# EAGLE design attiny_programmer (EAGLE 8.3.2)
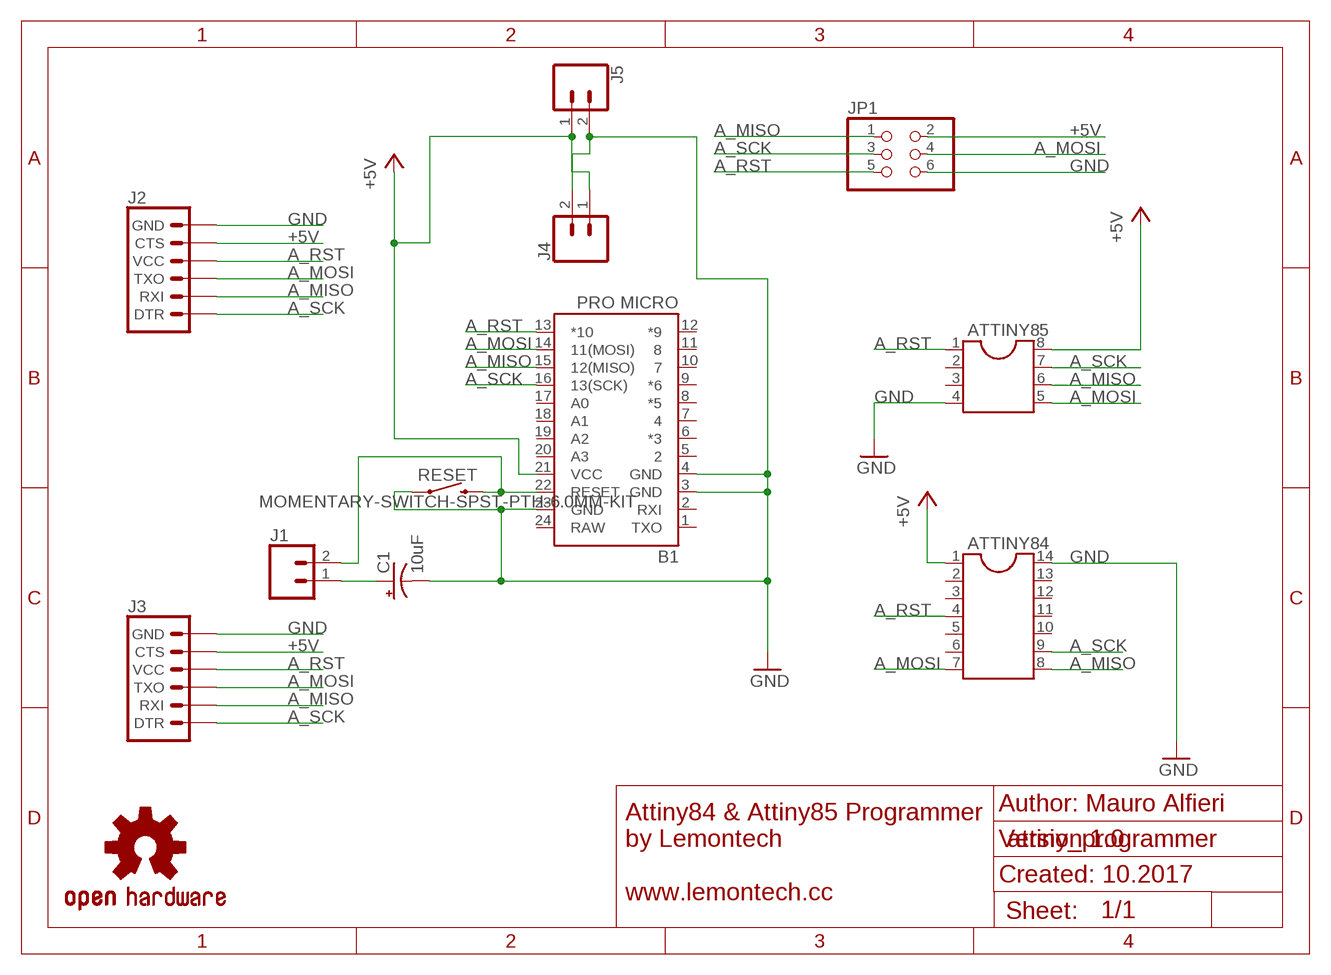
[diagram p0: schematic, sheet 1]

## Parts
ATTINY84  DIL14S  [SOCKET-14]
ATTINY85  DIL8S  [SOCKET-08]
B1  PRO MICRO  SPARKFUN_PRO_MICRO  [SPARKFUN_PRO_MICRO]
C1  10uF  10UF-POLAR-RADIAL-2.5MM-25V-20%  [CPOL-RADIAL-2.5MM-5MM]
J1  CONN_02  [1X02]
J2  6_PIN_SERIAL_TARGETLONGPADS  [1X06_LONGPADS]
J3  6_PIN_SERIAL_TARGETLONGPADS  [1X06_LONGPADS]
J4  CONN_02  [1X02]
J5  CONN_02  [1X02]
JP1  PINHD-2X3  [2X03]
LOGO1  OSHW-LOGOMINI  [OSHW-LOGO-MINI]
RESET  MOMENTARY-SWITCH-SPST-PTH-6.0MM-KIT  [TACTILE_SWITCH_PTH_6.0MM_KIT]

## Nets
+5V: ATTINY84.1 ATTINY85.8 B1.21(VCC) J2.5(CTS) J3.5(CTS) J4.1 J5.1 JP1.2
A_MISO: ATTINY84.8 ATTINY85.6 B1.15(12(MISO)) J2.2(RXI) J3.2(RXI) JP1.1
A_MOSI: ATTINY84.7 ATTINY85.5 B1.14(11(MOSI)) J2.3(TXO) J3.3(TXO) JP1.4
A_RST: ATTINY84.4 ATTINY85.1 B1.13(*10) J2.4(VCC) J3.4(VCC) JP1.5
A_SCK: ATTINY84.9 ATTINY85.7 B1.16(13(SCK)) J2.1(DTR) J3.1(DTR) JP1.3
GND: ATTINY84.14 ATTINY85.4 B1.3(GND) B1.4(GND) B1.23(GND) C1.2(-) J2.6(GND) J3.6(GND) J4.2 J5.2 JP1.6 RESET.1
N$2: B1.22(RESET) J1.2 RESET.3
N$4: C1.1(+) J1.1
Unconnected: ATTINY84.2 ATTINY84.3 ATTINY84.5 ATTINY84.6 ATTINY84.10 ATTINY84.11 ATTINY84.12 ATTINY84.13 ATTINY85.2 ATTINY85.3 B1.1(TXO) B1.2(RXI) B1.5 B1.6(*3) B1.7 B1.8(*5) B1.9(*6) B1.10 B1.11 B1.12(*9) B1.17(A0) B1.18(A1) B1.19(A2) B1.20(A3)

## Notes on the sheet
- Author: Mauro Alfieri
- Version 1.0
- Created: 10.2017
- Attiny84 & Attiny85 Programmer
  by Lemontech
  
  www.lemontech.cc

## Power pins joined to a net without a drawn wire
RAW: B1.24(RAW)

## Library data of the parts
ATTINY84 = ic-package:DIL14: Dual In Line / Socket
ATTINY85 = ic-package:DIL8: Dual In Line / Socket
B1 = SparkFun-Boards:SPARKFUN_PRO_MICRO: SparkFun Pro Micro Atmega32U4 compatible footprint. SparkFun Products: 3.3V/8MHz <https://www.sparkfun.com/products/12587> 5V/16MHz <https://www.sparkfun.com/products/12640>
C1 = SparkFun-Capacitors:10UF-POLAR: 10.0µF polarized capacitors A capacitor is a passive two-terminal electrical component used to store electrical energy temporarily in an electric field.; PROD_ID: CAP-08440
J1 J4 J5 = SparkFun-Connectors:CONN_02: Multi connection point. Often used as Generic Header-pin footprint for 0.1 inch spaced/style header connections On any of the 0.1 inch spaced packages, you can populate with these: Break Away Headers - Straight <https://www.sparkfun.com/products/116> (PRT-00116) Break Away Male Headers - Right Angle <https://www.sparkfun.com/products/553> (PRT-00553) Female Headers <https://www.sparkfun.com/products/115> (PRT-00115) Break Away Headers - Machine Pin <https://www.sparkfun.com/products/117> (PRT-00117) Break Away Female Headers - Swiss Machine Pin <https://www.sparkfun.com/products/743> (PRT-00743) For SCREWTERMINALS and SPRING TERMINALS visit here: Screw Terimnals on SparkFun.com <https://www.sparkfun.com/search/results?term=Screw+Terminals> (5mm/3.5mm/2.54mm spacing) This device is also useful as a general connection point to wire up your design to another part of your project. Our various solder wires solder well into these plated through hole pads. Hook-Up Wire - Assortment (Stranded, 22 AWG) <https://www.sparkfun.com/products/11375> (PRT-11375) Hook-Up Wire - Assortment (Solid Core, 22 AWG) <https://www.sparkfun.com/products/11367> (PRT-11367) View the entire wire category on our website here <https://www.sparkfun.com/categories/141> Special notes: Molex polarized connector foot print use with: PRT-08233 with associated crimp pins and housings. 2.54_SCREWTERM for use with PRT-10571. 3.5mm Screw Terminal footprints for PRT-08084 5mm Screw Terminal footprints for use with PRT-08432
J2 J3 = SparkFun-Connectors:6_PIN_SERIAL_TARGET: 6-pin header connection for use with the "FTDI BASIC" pinout - TARGET SIDE. Also known as "Arduino Serial Program Header". It is used to mate with our FTDI Basic serial programmers using the Arduino IDE. Note, this device has "TARGET" in the name. It is intended to be used on a design that contains a target micro-controller that you wish to program. The "sister" device, named "CABLE" is inteneded to be used on a design that usually lives on the end of your USB cable and prvides the converter chip (FTDI232 or FTDI231x) to commnicate serial RX/TX. You can populate with some of these: Break Away Headers - Straight <https://www.sparkfun.com/products/116> (PRT-00116) For reference (or to suit your programming needs) check out these designs: SparkFun FTDI Basic Breakout - 5V <https://www.sparkfun.com/products/9716> (DEV-09716) SparkFun FTDI Basic Breakout - 3.3V <https://www.sparkfun.com/products/9873> (DEV-09873) SparkFun FTDI SmartBasic <https://www.sparkfun.com/products/12935> (DEV-12935) SparkFun Beefy 3 - FTDI Basic Breakout <https://www.sparkfun.com/products/13746> (DEV-13746)
JP1 = SparkFun:PINHD-2X3: PIN HEADER
LOGO1 = SparkFun-Aesthetics:OSHW-LOGO: Open-Source Hardware (OSHW) Logo This logo indicates the piece of hardware it is found on incorporates a OSHW license and/or adheres to the definition of open source hardware found here: http://freedomdefined.org/OSHW
RESET = SparkFun-Switches:MOMENTARY-SWITCH-SPST: Momentary Switch (Pushbutton) - SPST Normally-open (NO) SPST momentary switches (buttons, pushbuttons). Variants PTH-12MM - 12mm square, through-hole Momentary Pushbutton Switch - 12mm Square <https://www.sparkfun.com/products/9190> (COM-09190) PTH-6.0MM, PTH-6.0MM-KIT - 6.0mm square, through-hole Mini Pushbutton Switch <https://www.sparkfun.com/products/97> (COM-00097) KIT package intended for soldering kit's - only one side of pads' copper is exposed. PTH-RIGHT-ANGLE-KIT - Right-angle, through-hole Right Angle Tactile Button <https://www.sparkfun.com/products/10791> - Used on SparkFun BigTime Watch Kit <https://www.sparkfun.com/products/11734> SMD-12MM - 12mm square, surface-mount Tactile Button - SMD (12mm) <https://www.sparkfun.com/products/12993> (COM-12993) Used on SparkFun PicoBoard <https://www.sparkfun.com/products/11888> SMD-4.5MM - 4.5mm Square Trackball Switch Used on SparkFun Blackberry Trackballer Breakout <https://www.sparkfun.com/products/13169> SMD-4.6MMX2.8MM - 4.60mm x 2.80mm, surface mount Used on SparkFun SAMD21 Mini Breakout <https://www.sparkfun.com/products/13664> SMD-5.2MM, SMD-5.2-REDUNDANT - 5.2mm square, surface-mount Mini Pushbutton Switch - SMD <https://www.sparkfun.com/products/8720> (COM-08720) Used on Arduino Pro Mini <https://www.sparkfun.com/products/11114> REDUNDANT package connects both switch circuits together SMD-6.0X3.5MM - 6.0 x 3.5mm, surface mount Momentary Reset Switch SMD <https://www.sparkfun.com/products/8229> (COM-08229) SMD-6.2MM-TALL - 6.2mm square, surface mount Tactile Button - SMD (6mm) <https://www.sparkfun.com/products/12992> Used on SparkFun Digital Sandbox <https://www.sparkfun.com/products/12651> SMD-RIGHT-ANGLE - Right-angle, surface mount Used on SparkFun Block for Intel® Edison - Arduino <https://www.sparkfun.com/products/13036>; PROD_ID: SWCH-08441; SF_SKU: COM-00097

## Board
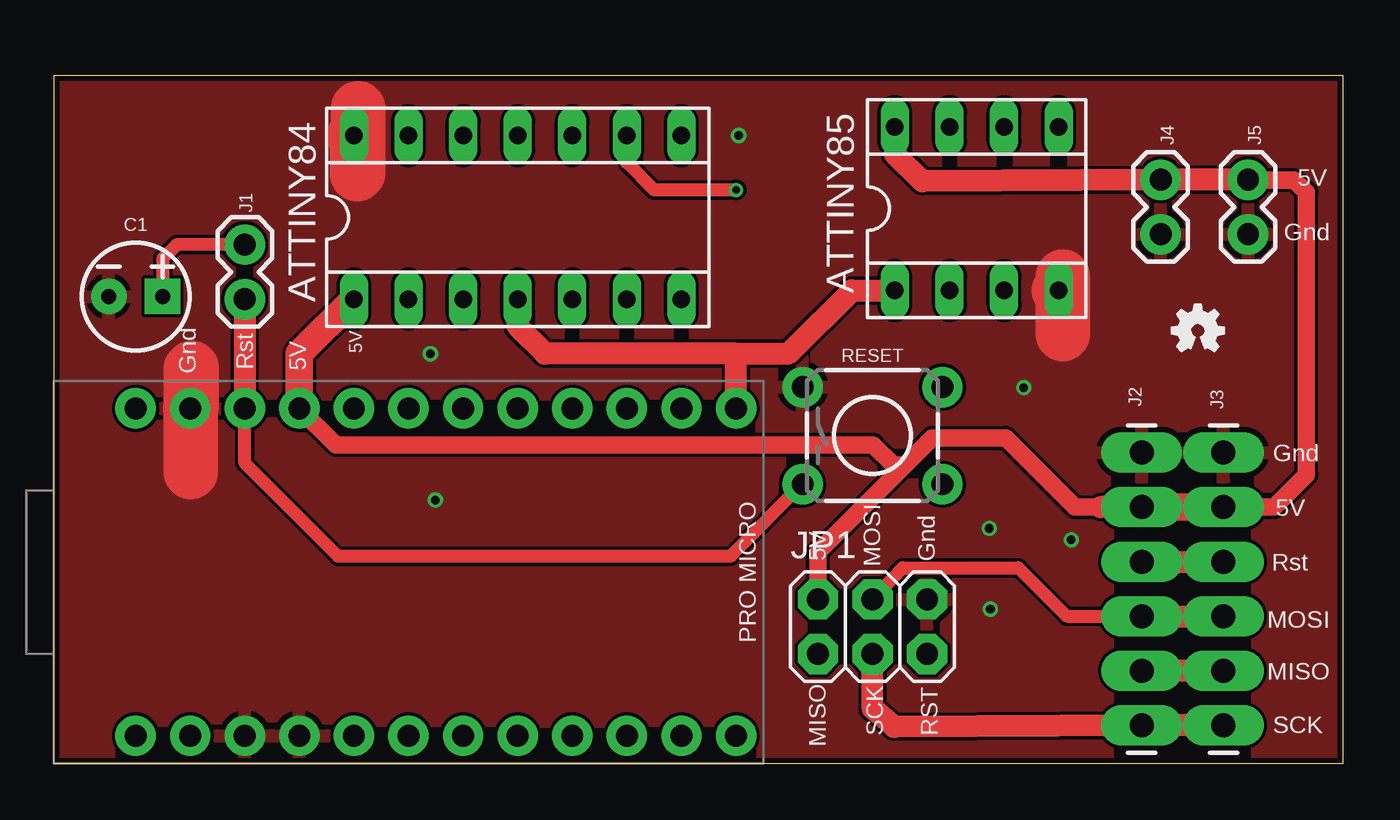
[diagram p1: board, top side]
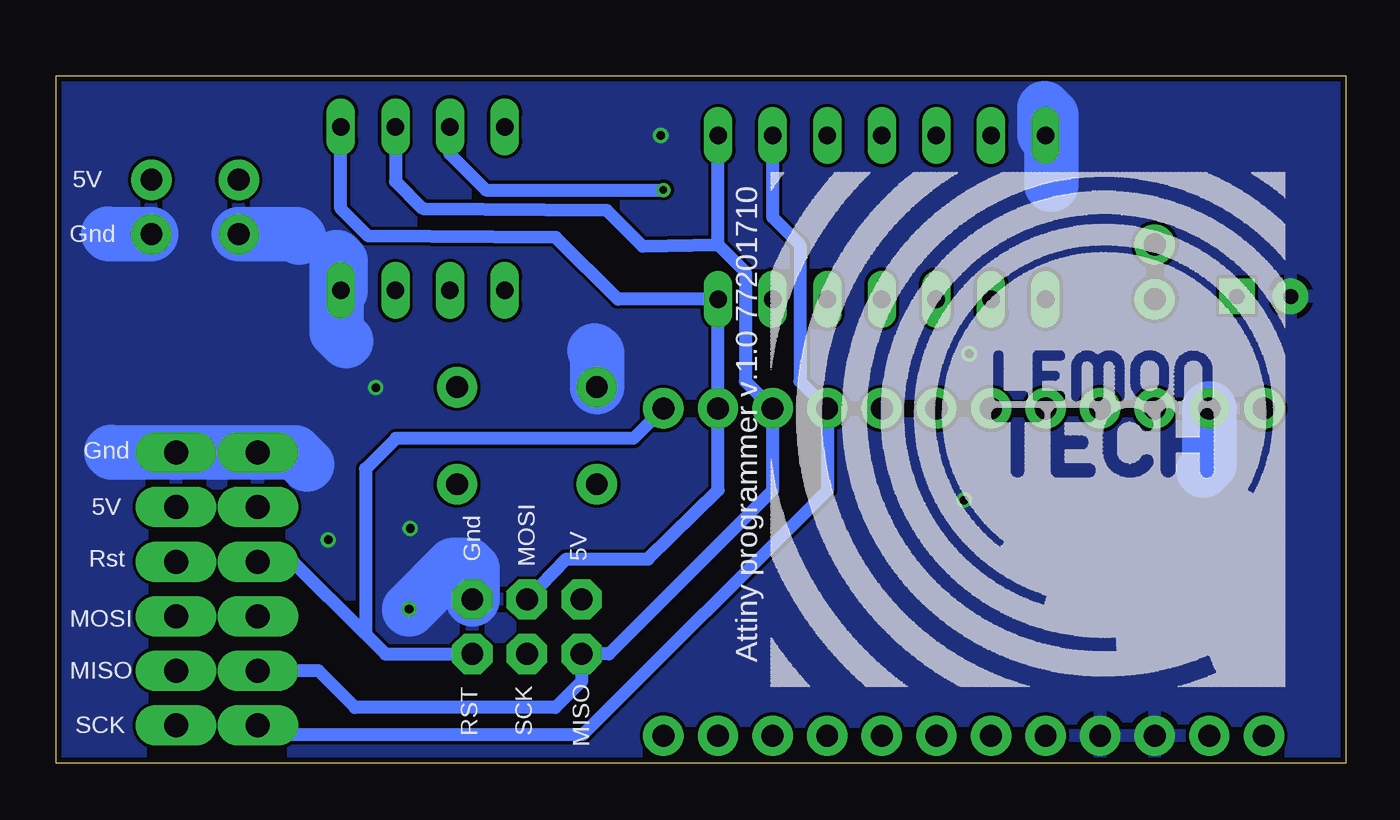
[diagram p2: board, bottom side, seen from below]

Size 60 x 32 mm. Coordinates in mm from the lower left corner, seen from the top.
Outline: 0,0 60,0 60,32 0,32 0,0
Copper layers (1*16): Top 0.035mm / dielectric 1.5mm / Bottom 0.035mm
Design rules "SeeedStudio_2layer_DRU_no_angle_20140221": minimum track width 6mil, minimum drill 12mil, track to track 6mil, track to pad 6mil, pad to pad 6mil, via to via 6mil, smd to smd 0mil, copper to edge 10mil, drill to drill 10mil, minimum pad ring 10mil, minimum via ring 6mil, stop-mask expansion 2mil, vias tented up to drill 100mil, thermal gap 10mil

### Footprints (pad centres in the part's own frame; a part is rotated, then mirrored left to right if it is on the bottom)
SOCKET-14 = drill 0.813 long: 1 -7.62,-3.81; 2 -5.08,-3.81; 3 -2.54,-3.81; 4 0,-3.81; 5 2.54,-3.81; 6 5.08,-3.81; 7 7.62,-3.81; 8 7.62,3.81; 9 5.08,3.81; 10 2.54,3.81; 11 0,3.81; 12 -2.54,3.81; 13 -5.08,3.81; 14 -7.62,3.81
SOCKET-08 = drill 0.813 long: 1 -3.81,-3.81; 2 -1.27,-3.81; 3 1.27,-3.81; 4 3.81,-3.81; 5 3.81,3.81; 6 1.27,3.81; 7 -1.27,3.81; 8 -3.81,3.81
SPARKFUN_PRO_MICRO = drill 1.016 pad 1.88: 1 -7.62,12.7; 2 -7.62,10.16; 3 -7.62,7.62; 4 -7.62,5.08; 5 -7.62,2.54; 6 -7.62,0; 7 -7.62,-2.54; 8 -7.62,-5.08; 9 -7.62,-7.62; 10 -7.62,-10.16; 11 -7.62,-12.7; 12 -7.62,-15.24; 13 7.62,-15.24; 14 7.62,-12.7; 15 7.62,-10.16; 16 7.62,-7.62; 17 7.62,-5.08; 18 7.62,-2.54; 19 7.62,0; 20 7.62,2.54; 21 7.62,5.08; 22 7.62,7.62; 23 7.62,10.16; 24 7.62,12.7
CPOL-RADIAL-2.5MM-5MM = drill 0.7 pad 1.651 square: 1 1.25,0 | drill 0.7 pad 1.651: 2 -1.25,0
1X02 = drill 1.016 pad 1.88: 1 0,0; 2 2.54,0
1X06_LONGPADS = drill 1.118 pad 1.88 long: 1 0,0; 2 2.54,0; 3 5.08,0; 4 7.62,0; 5 10.16,0; 6 12.7,0
2X03 = drill 1.016 pad 1.88 octagon: 1 -2.54,-1.27; 2 -2.54,1.27; 3 0,-1.27; 4 0,1.27; 5 2.54,-1.27; 6 2.54,1.27
TACTILE_SWITCH_PTH_6.0MM_KIT = drill 1.016 pad 1.88: 1 -3.251,2.261; 2 3.251,2.261; 3 -3.251,-2.261; 4 3.251,-2.261

### Placement (x,y rotation side)
ATTINY84  21.59,25.4 0 top
ATTINY85  42.95,25.81 0 top
B1  16.51,8.89 90 top
C1  3.81,21.72 0 top
J1  8.89,24.13 270 top
J2  50.62,1.75 90 top
J3  54.43,1.75 90 top
J4  51.51,27.15 270 top
J5  55.58,27.15 270 top
JP1  38.1,6.35 0 top
LOGO1  53.24,20.14 0 top
RESET  38.1,15.24 0 top
U$1  [LOGO_1MIL]  26.77,3.53 0 bottom

### Tracks (layer width: path | path; a pad name or v marks a point on that pad's centre or on a via)
+5V
  Top 0.813: JP1.2 35.56,9.83 39.6,13.87 | J2.5 47.52,11.91 44.3,15.14 40.87,15.14 39.6,13.87 | B1.21 13.13,14.81 38.12,14.81 39.06,13.87 39.6,13.87 | J3.5 56.79,11.91 58.29,13.41 58.29,26.57 57.73,27.13 55.6,27.13 J5.1
  Top 1.016: ATTINY85.8 39.14,28.35 40.41,27.08 J4.1 J5.1 | J2.5 48.72,11.91
  Top 1.27: J2.5 J3.5 | B1.21 11.43,19.05 ATTINY84.1
A_MISO
  Top 1.016: J3.2 J2.2
  Bottom 0.61: ATTINY85.6 44.22,27.08 42.95,25.81 34.39,25.73 32.72,24.05 29.21,24.13 | 29.21,24.13 27.94,22.86 27.94,17.78 B1.15 26.67,12.7 34.29,5.08 JP1.1 35.56,3.81 36.78,2.59 46.1,2.59 47.8,4.29 J2.2 | 29.21,24.13 ATTINY84.8
A_MOSI
  Top 0.61: JP1.4 39.5,9.09 44.88,9.09 47.14,6.83 J2.3
  Top 1.016: J2.3 J3.3
  Bottom 0.61: JP1.4 36.27,9.5 32.46,9.5 29.21,12.7 B1.14 ATTINY84.7 33.86,21.59 36.75,24.46 45.49,24.54 46.76,25.81 ATTINY85.5
A_RST
  Top 1.016: B1.13 31.75,19.05 | 31.75,19.05 22.86,19.05 21.59,20.32 ATTINY84.4 | J2.4 J3.4 | 31.75,19.05 34.13,19.05 34.19,19.1 34.24,19.1 37.13,22 ATTINY85.1
  Bottom 0.61: B1.13 33.15,15.11 44.2,15.11 45.62,13.69 45.62,6.02 | 45.62,6.02 44.68,5.08 JP1.5 | 45.62,6.02 48.97,9.37 J2.4
A_SCK  (via drill 0.35)
  Top 0.152: 26.67,29.11 ATTINY84.9
  Top 0.61: v31.75,26.67 27.94,26.67 26.67,27.94 26.67,29.11
  Top 1.016: J3.1 J2.1 39.12,1.68 38.1,2.54 JP1.3
  Bottom 0.61: ATTINY84.9 26.67,25.4 25.4,24.13 25.4,17.78 B1.16 24.13,12.7 35.51,1.32 50.19,1.32 J2.1 | ATTINY85.7 41.68,28.35 40.01,26.67 v31.75,26.67
GND  (via drill 0.4)
  Top 2.54: ATTINY85.4 46.97,21.79 | 46.97,21.79 46.97,19.96 | 46.97,21.79 46.97,22.63 | B1.23 6.43,16.59 6.43,18.39 6.38,18.34 6.38,13.54 | ATTINY84.14 14.12,29.06 14.12,27.41 14.17,27.46 14.17,30.48
  Bottom 2.54: 48.33,13.9 48.88,14.45 J3.6 57.43,14.45 57.45,14.48 | JP1.6 40.64,9.04 40.82,9.22 41.53,9.22 v43.59,7.16 | B1.23 6.35,13.89 6.63,13.61 | J5.2 57.56,24.61 57.58,24.64 | J4.2 48.84,24.61 48.69,24.46 | ATTINY85.4 46.76,23.36 46.95,23.56 46.95,20.08 46.51,19.63 | RESET.1 34.85,19.1 34.95,19.2 | ATTINY84.14 14.02,29.26 14.02,30.48 13.69,30.15 13.69,26.92
  other vias: 17.53,19.05 31.88,29.21 45.14,17.48 47.35,10.39 43.54,10.92 17.75,12.24
  pour Bottom: -0.61,32.89 60.53,32.79 60.43,-1.47 -0.81,-1.4
  pour Top: -0.13,32.26 60.02,32.13 59.84,-0.89 -0.2,-0.79
N$2
  Top 0.61: B1.22 8.89,13.97 13.23,9.63 31.5,9.63 RESET.3
  Top 1.016: J1.2 B1.22
N$4
  Top 0.61: J1.1 5.71,24.13 5.08,23.5 5.08,21.74 C1.1

### Text on the board
bPlace: Attiny programmer v.1.0 77201710
tNames: 5V | Gnd | 5V | Gnd | Rst | 5V | Gnd | 5V | Rst | 5V | MOSI | Gnd | MOSI | MISO | MISO | SCK | RST | SCK
bNames: 5V | Gnd | Gnd | 5V | 5V | MOSI | Gnd | Rst | MOSI | MISO | MISO | SCK | RST | SCK